# Altium project CapsuleBase.PrjPCB
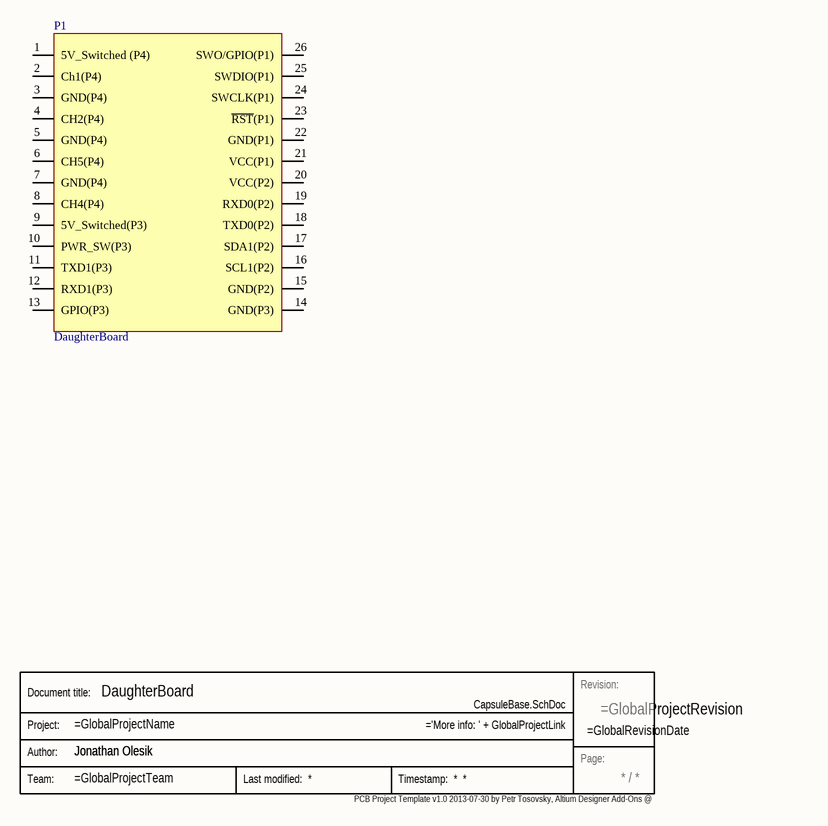
[diagram p0: CapsuleBase.SchDoc]
1 sheet, 2 parts. Net scope: global (net labels, ports and power ports of the same name join across sheets).
Board file: CapsuleBase.PcbDoc

## Sheet CapsuleBase.SchDoc: DaughterBoard
size A4; Author: Jonathan Olesik

### Parts
P1  DaughterBoard  [PowerBoardDaughter]
Stamp  Stamp  (value not drawn)  (graphical)

### Nets

Not connected (* = marked no-connect by the designer): P1 1(5V_Switched_(P4)) 2(Ch1(P4)) 3(GND(P4)) 4(CH2(P4)) 5(GND(P4)) 6(CH5(P4)) 7(GND(P4)) 8(CH4(P4)) 9(5V_Switched(P3)) 10(PWR_SW(P3)) 11(TXD1(P3)) 12(RXD1(P3)) 13(GPIO(P3)) 14(GND(P3)) 15(GND(P2)) 16(SCL1(P2)) 17(SDA1(P2)) 18(TXD0(P2)) 19(RXD0(P2)) 20(VCC(P2)) 21(VCC(P1)) 22(GND(P1)) 23(~{RST}(P1)) 24(SWCLK(P1)) 25(SWDIO(P1)) 26(SWO/GPIO(P1))

### Notes on the sheet
- PCB Project Template v1.0 2013-07-30 by Petr Tosovsky, Altium Designer Add-Ons @ <http://www.edatools.cz/addons>
- (in symbol Stamp) Revision:; Document title:; Project:; Author:; Page:; Team: